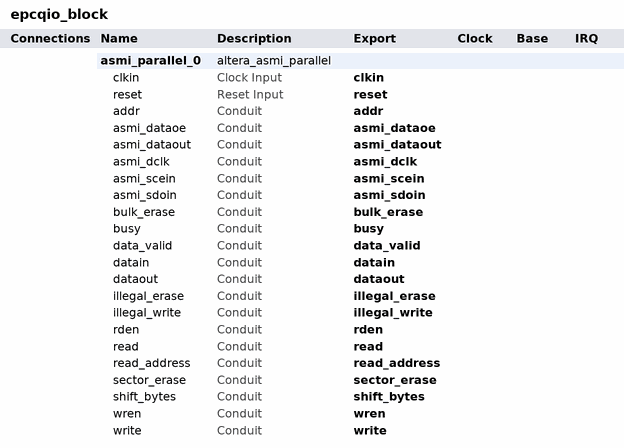
[diagram p0: system contents]
# Platform Designer (Qsys) system epcqio_block, Cyclone V 5CEBA5F23C7
# Parameters at their usual value, and those the tool derives, are not listed.
package require -exact qsys 20.1
create_system epcqio_block
set_project_property DEVICE_FAMILY {Cyclone V}
set_project_property DEVICE 5CEBA5F23C7

add_instance asmi_parallel_0 altera_asmi_parallel 20.1
set_instance_property asmi_parallel_0 AUTO_EXPORT true
set_instance_parameter_value asmi_parallel_0 CBX_AUTO_BLACKBOX ALL
set_instance_parameter_value asmi_parallel_0 DATA_WIDTH STANDARD
set_instance_parameter_value asmi_parallel_0 ENABLE_SIM false
set_instance_parameter_value asmi_parallel_0 EPCS_TYPE EPCQ64
set_instance_parameter_value asmi_parallel_0 FLASH_RSTPIN FALSE
set_instance_parameter_value asmi_parallel_0 PAGE_SIZE 256
set_instance_parameter_value asmi_parallel_0 WRITE_DUMMY_CLK 0
set_instance_parameter_value asmi_parallel_0 gui_bulk_erase true
set_instance_parameter_value asmi_parallel_0 gui_die_erase false
set_instance_parameter_value asmi_parallel_0 gui_ex4b_addr false
set_instance_parameter_value asmi_parallel_0 gui_fast_read false
set_instance_parameter_value asmi_parallel_0 gui_page_write true
set_instance_parameter_value asmi_parallel_0 gui_read_address true
set_instance_parameter_value asmi_parallel_0 gui_read_dummyclk false
set_instance_parameter_value asmi_parallel_0 gui_read_rdid false
set_instance_parameter_value asmi_parallel_0 gui_read_sid false
set_instance_parameter_value asmi_parallel_0 gui_read_status false
set_instance_parameter_value asmi_parallel_0 gui_sector_erase true
set_instance_parameter_value asmi_parallel_0 gui_sector_protect false
set_instance_parameter_value asmi_parallel_0 gui_single_write false
set_instance_parameter_value asmi_parallel_0 gui_use_asmiblock true
set_instance_parameter_value asmi_parallel_0 gui_use_eab false
set_instance_parameter_value asmi_parallel_0 gui_wren true
set_instance_parameter_value asmi_parallel_0 gui_write true

# exported interfaces
add_interface addr conduit end
set_interface_property addr EXPORT_OF asmi_parallel_0.addr
add_interface asmi_dataoe conduit end
set_interface_property asmi_dataoe EXPORT_OF asmi_parallel_0.asmi_dataoe
add_interface asmi_dataout conduit end
set_interface_property asmi_dataout EXPORT_OF asmi_parallel_0.asmi_dataout
add_interface asmi_dclk conduit end
set_interface_property asmi_dclk EXPORT_OF asmi_parallel_0.asmi_dclk
add_interface asmi_scein conduit end
set_interface_property asmi_scein EXPORT_OF asmi_parallel_0.asmi_scein
add_interface asmi_sdoin conduit end
set_interface_property asmi_sdoin EXPORT_OF asmi_parallel_0.asmi_sdoin
add_interface bulk_erase conduit end
set_interface_property bulk_erase EXPORT_OF asmi_parallel_0.bulk_erase
add_interface busy conduit end
set_interface_property busy EXPORT_OF asmi_parallel_0.busy
add_interface clkin clock sink
set_interface_property clkin EXPORT_OF asmi_parallel_0.clkin
add_interface data_valid conduit end
set_interface_property data_valid EXPORT_OF asmi_parallel_0.data_valid
add_interface datain conduit end
set_interface_property datain EXPORT_OF asmi_parallel_0.datain
add_interface dataout conduit end
set_interface_property dataout EXPORT_OF asmi_parallel_0.dataout
add_interface illegal_erase conduit end
set_interface_property illegal_erase EXPORT_OF asmi_parallel_0.illegal_erase
add_interface illegal_write conduit end
set_interface_property illegal_write EXPORT_OF asmi_parallel_0.illegal_write
add_interface rden conduit end
set_interface_property rden EXPORT_OF asmi_parallel_0.rden
add_interface read conduit end
set_interface_property read EXPORT_OF asmi_parallel_0.read
add_interface read_address conduit end
set_interface_property read_address EXPORT_OF asmi_parallel_0.read_address
add_interface reset reset sink
set_interface_property reset EXPORT_OF asmi_parallel_0.reset
add_interface sector_erase conduit end
set_interface_property sector_erase EXPORT_OF asmi_parallel_0.sector_erase
add_interface shift_bytes conduit end
set_interface_property shift_bytes EXPORT_OF asmi_parallel_0.shift_bytes
add_interface wren conduit end
set_interface_property wren EXPORT_OF asmi_parallel_0.wren
add_interface write conduit end
set_interface_property write EXPORT_OF asmi_parallel_0.write

set_interconnect_requirement {$system} qsys_mm.clockCrossingAdapter HANDSHAKE
set_interconnect_requirement {$system} qsys_mm.enableEccProtection FALSE
set_interconnect_requirement {$system} qsys_mm.insertDefaultSlave FALSE
set_interconnect_requirement {$system} qsys_mm.maxAdditionalLatency 1

save_system epcqio_block.qsys
